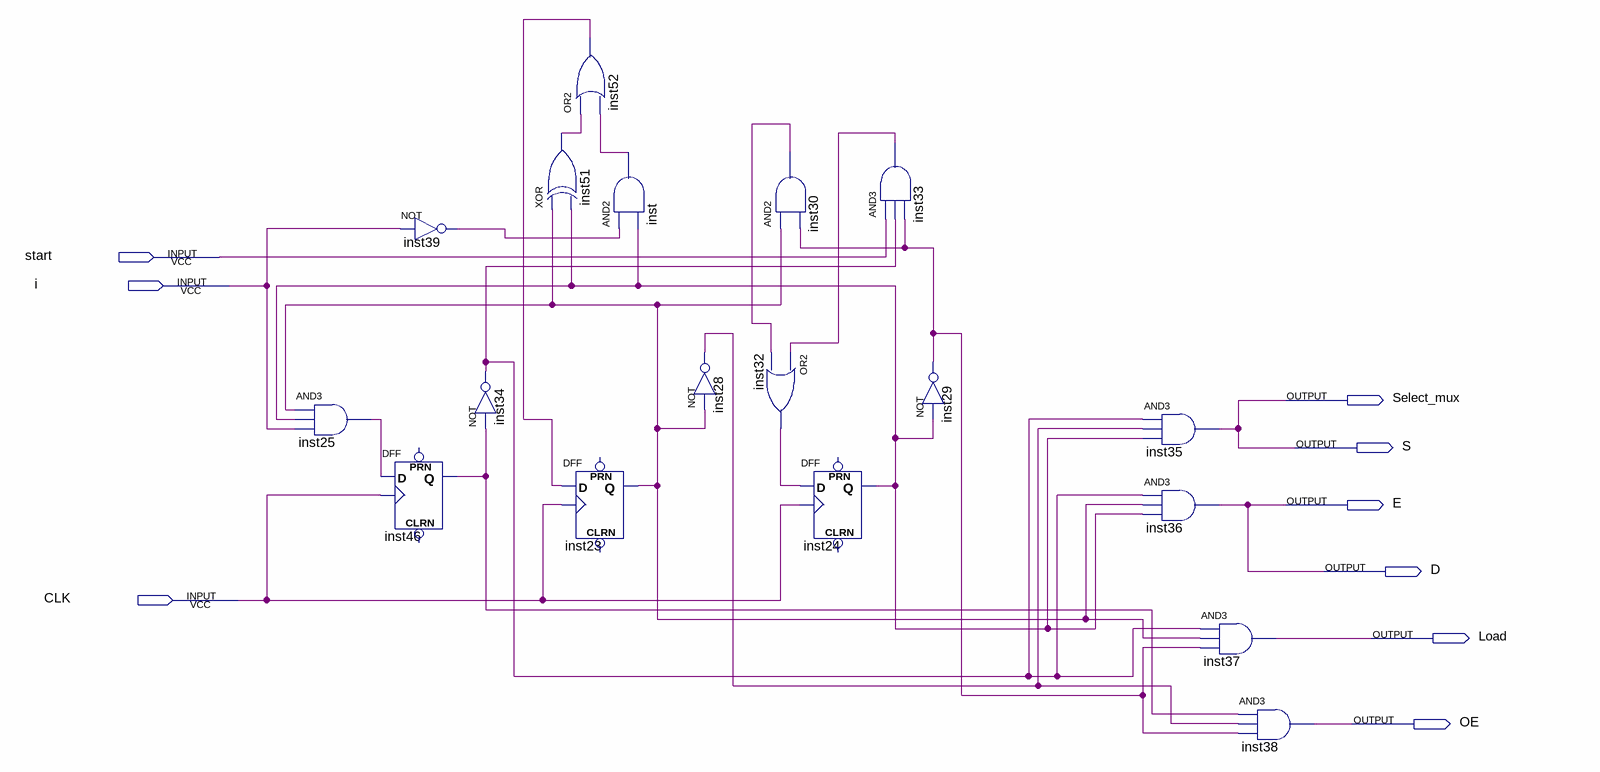
[diagram p0: schematic sheet]
// Quartus schematic controller.bdf as structural Verilog: 18 symbols, 9 pins
module controller (
  input  start,
  input  i,
  input  CLK,
  output Select_mux,
  output S,
  output E,
  output D,
  output Load,
  output OE
);

  wire inst23_q, inst24_q, inst25_out, inst28_out, inst29_out, inst30_out, inst32_out, inst33_out,
       inst34_out, inst39_out, inst46_q, inst51_out, inst52_out, inst_out;

  and inst25 (inst25_out, inst23_q, inst24_q, i);
  not inst39 (inst39_out, i);
  DFF inst46 (.CLK(CLK), .D(inst25_out), .Q(inst46_q));  // open: CLRN, PRN
  not inst34 (inst34_out, inst46_q);
  or inst52 (inst52_out, inst51_out, inst_out);
  xor inst51 (inst51_out, inst23_q, inst24_q);
  DFF inst23 (.CLK(CLK), .D(inst52_out), .Q(inst23_q));  // open: CLRN, PRN
  and inst (inst_out, inst39_out, inst24_q);
  not inst28 (inst28_out, inst23_q);
  and inst30 (inst30_out, inst23_q, inst29_out);
  or inst32 (inst32_out, inst33_out, inst30_out);
  DFF inst24 (.CLK(CLK), .D(inst32_out), .Q(inst24_q));  // open: CLRN, PRN
  and inst33 (inst33_out, start, inst34_out, inst29_out);
  not inst29 (inst29_out, inst24_q);
  and inst35 (S, inst34_out, inst28_out, inst24_q);
  and inst36 (D, inst34_out, inst23_q, inst24_q);
  and inst37 (Load, inst34_out, inst23_q, inst29_out);
  and inst38 (OE, inst46_q, inst28_out, inst29_out);

  assign E = D;
  assign Select_mux = S;
endmodule
